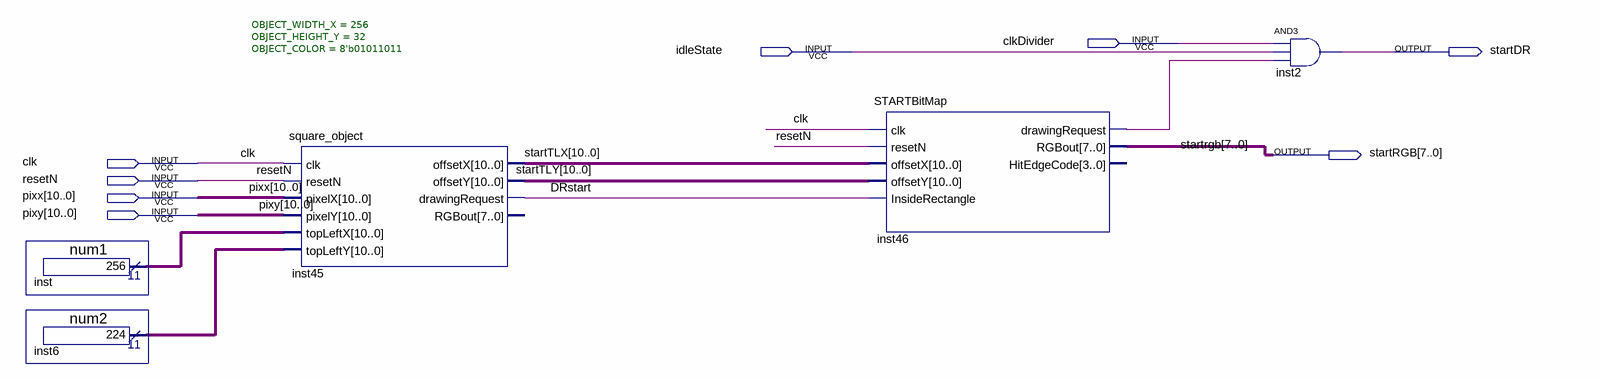
[diagram p0: schematic sheet]
// Quartus schematic startDisplay.bdf as structural Verilog: 5 symbols, 8 pins
module startDisplay (
  input  clkDivider,
  input  idleState,
  input  clk,
  input  resetN,
  input  [10:0] pixx,
  input  [10:0] pixy,
  output startDR,
  output [7:0] startRGB
);

  wire DRstart, inst46_drawingrequest;
  wire [10:0] inst6_result, inst_result, startTLX, startTLY;

  num1 inst (.result(inst_result));
  num2 inst6 (.result(inst6_result));
  square_object #(.OBJECT_WIDTH_X(256), .OBJECT_HEIGHT_Y(32), .OBJECT_COLOR(8'b01011011)) inst45 (
    .clk(clk), .resetN(resetN), .pixelX(pixx), .pixelY(pixy), .topLeftX(inst_result),
    .topLeftY(inst6_result), .offsetX(startTLX), .offsetY(startTLY), .drawingRequest(DRstart));  // open: RGBout
  STARTBitMap inst46 (
    .clk(clk), .resetN(resetN), .offsetX(startTLX), .offsetY(startTLY), .InsideRectangle(DRstart),
    .drawingRequest(inst46_drawingrequest), .RGBout(startRGB));  // open: HitEdgeCode
  and inst2 (startDR, clkDivider, idleState, inst46_drawingrequest);
endmodule
